# Altium project UZ_A_Testboard.PrjPcb
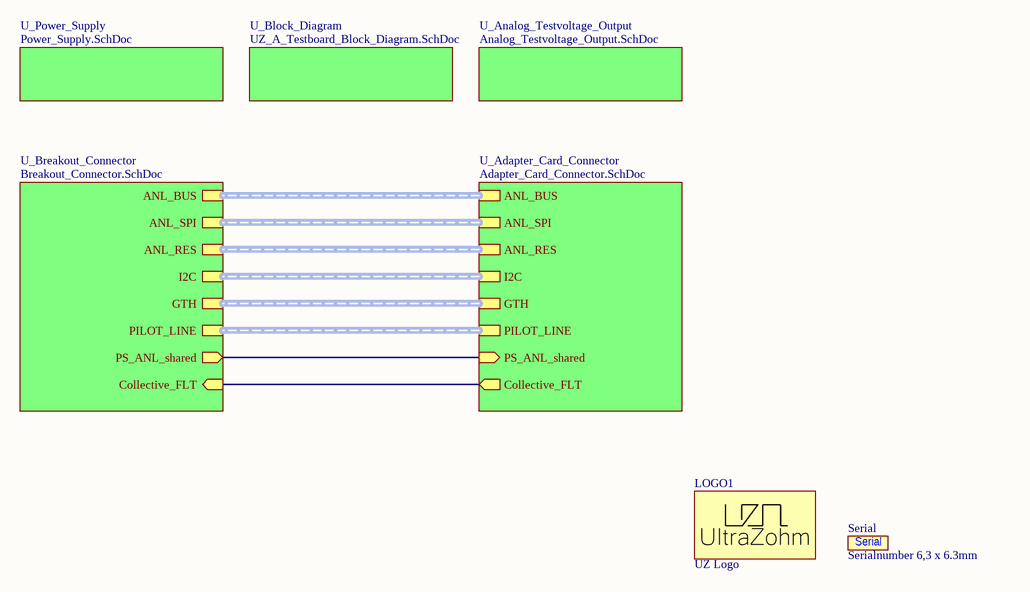
[diagram p0: Topsheet.SchDoc]
AuthorParam: Andreas Geiger; ProjectDate: 04/2021; ProjectRevision: Rev01
6 sheets, 57 parts. Net scope: hierarchical (ports join the sheet entries above them; power ports are global).
Board file: UZ_A_Testboard.PcbDoc
Sheets:
  Topsheet.SchDoc
    U_Adapter_Card_Connector = Adapter_Card_Connector.SchDoc
    U_Breakout_Connector = Breakout_Connector.SchDoc
    U_Power_Supply = Power_Supply.SchDoc
    U_Block_Diagram = UZ_A_Testboard_Block_Diagram.SchDoc
    U_Analog_Testvoltage_Output = Analog_Testvoltage_Output.SchDoc

## Sheet Topsheet.SchDoc
size A4; PageSetup: Record=PageOptions|CenterHorizontal=True|CenterVertical=True|PrintScale=0.92|XCorrection=1.00|YCorrection=1.00|PrintKind=0|BorderSize=5000000|LeftOffset=0|BottomOffset=0|Orientation=2|PaperLength=1000|PaperWidth=1000|Scale=100|PaperSource=7|PrintQuality=-4|MediaType=1|DitherType=10|PrintScaleMode=1|PaperKind=A4; Author: Andreas Geiger; CompanyName: Technische Hochschule Nürnberg Georg Simon Ohm; Organization: UltraZohm; Address1: Kesslerplatz 12; Address2: 90489 Nürnberg; Address3: GERMANY; DocumentNumber: 5; SheetNumber: 5; SheetTotal: 5; Website: www.ultrazohm.com

### Parts
LOGO1  UZ Logo  [UZ_Logo_small]  (no BOM)
Serial  Serialnumber 6,3 x 6.3mm  [Serial_6.3x6.3mm]  (no BOM)

### Sub-sheets
U_Adapter_Card_Connector = Adapter_Card_Connector.SchDoc: I2C (harness I2C), PILOT_LINE (harness PILOT_LINE), Collective_FLT (out), PS_ANL_shared (in), ANL_SPI (harness ANL_SPI), GTH (harness GTH), ANL_RES (harness ANL_RES), ANL_BUS (harness ANL_BUS)
U_Analog_Testvoltage_Output = Analog_Testvoltage_Output.SchDoc: no entries
U_Block_Diagram = UZ_A_Testboard_Block_Diagram.SchDoc: no entries
U_Breakout_Connector = Breakout_Connector.SchDoc: I2C (harness I2C), PILOT_LINE (harness PILOT_LINE), ANL_SPI (harness ANL_SPI), GTH (harness GTH), ANL_RES (harness ANL_RES), ANL_BUS (harness ANL_BUS), Collective_FLT (in), PS_ANL_shared (out)
U_Power_Supply = Power_Supply.SchDoc: no entries

### Nets
Collective_FLT: sheet U_Adapter_Card_Connector/Collective_FLT, sheet U_Breakout_Connector/Collective_FLT
PS_ANL_shared: sheet U_Adapter_Card_Connector/PS_ANL_shared, sheet U_Breakout_Connector/PS_ANL_shared

### Buses and harness runs
harness sheet U_Adapter_Card_Connector/ANL_BUS = sheet U_Breakout_Connector/ANL_BUS
harness sheet U_Adapter_Card_Connector/ANL_RES = sheet U_Breakout_Connector/ANL_RES
harness sheet U_Adapter_Card_Connector/ANL_SPI = sheet U_Breakout_Connector/ANL_SPI
harness sheet U_Adapter_Card_Connector/GTH = sheet U_Breakout_Connector/GTH
harness sheet U_Adapter_Card_Connector/I2C = sheet U_Breakout_Connector/I2C
harness sheet U_Adapter_Card_Connector/PILOT_LINE = sheet U_Breakout_Connector/PILOT_LINE

### Notes on the sheet
- Title
- Revision:
- Design Engineer:
- Date:
- Project:
- Sheet
- of

### Library data of the parts
LOGO1 = UZ Logo: UltraZohm Logo on PCB; Created: Jan2021_Liegmann; Value: UZ Logo
Serial = SerialNumber: Created: 2018_09_18_AGeiger; Value: Serialnumber 6,3 x 6.3mm

## Sheet Adapter_Card_Connector.SchDoc
size A4; PageSetup: Record=PageOptions|CenterHorizontal=True|CenterVertical=True|PrintScale=0.92|XCorrection=1.00|YCorrection=1.00|PrintKind=0|BorderSize=5000000|LeftOffset=0|BottomOffset=0|Orientation=2|PaperLength=1000|PaperWidth=1000|Scale=100|PaperSource=7|PrintQuality=-4|MediaType=1|DitherType=10|PrintScaleMode=1|PaperKind=A4; Author: Andreas Geiger; CompanyName: Technische Hochschule Nürnberg Georg Simon Ohm; Organization: UltraZohm; Address1: Kesslerplatz 12; Address2: 90489 Nürnberg; Address3: GERMANY; DocumentNumber: 2; SheetNumber: 2; SheetTotal: 5; Website: www.ultrazohm.com
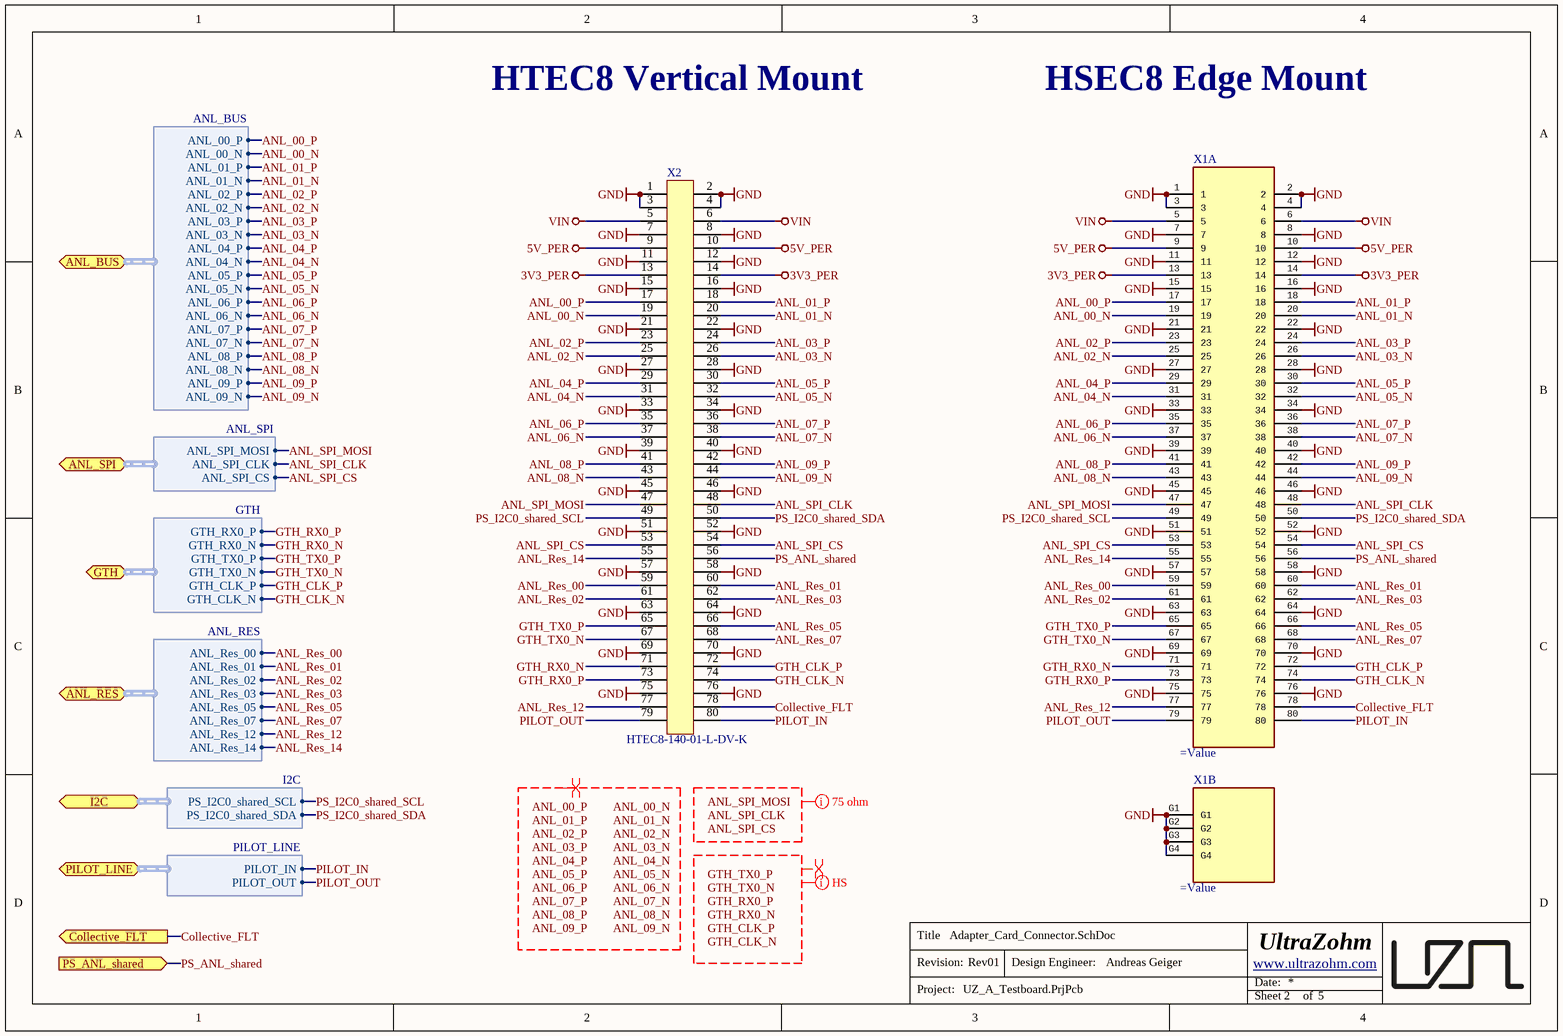
[diagram p1: Adapter_Card_Connector.SchDoc]

### Parts
X1  (no value)  [HSEC8-140-01-L-D-EM2]  (parts A,B of 2)
X2  HTEC8-140-01-L-DV-K  [HTEC8-140-XX-X-DV]

### Ports
ANL_BUS (bidir, harness ANL_BUS), ANL_RES (bidir, harness ANL_RES), ANL_SPI (bidir, harness ANL_SPI), Collective_FLT (out), GTH (bidir, harness GTH), I2C (bidir, harness I2C), PILOT_LINE (bidir, harness PILOT_LINE), PS_ANL_shared (in)

### Harnesses
I2C: PS_I2C0_shared_SDA, PS_I2C0_shared_SCL
PILOT_LINE: PILOT_OUT, PILOT_IN
ANL_BUS: ANL_00_P, ANL_00_N, ANL_01_P, ANL_01_N, ANL_02_P, ANL_02_N, ANL_03_P, ANL_03_N, ANL_04_P, ANL_04_N, ANL_05_P, ANL_05_N, ANL_06_P, ANL_06_N, ANL_07_P, ANL_07_N, ANL_08_P, ANL_08_N, ANL_09_P, ANL_09_N
ANL_RES: ANL_Res_00, ANL_Res_01, ANL_Res_02, ANL_Res_03, ANL_Res_05, ANL_Res_07, ANL_Res_12, ANL_Res_14
GTH: GTH_RX0_P, GTH_RX0_N, GTH_TX0_P, GTH_TX0_N, GTH_CLK_P, GTH_CLK_N
ANL_SPI: ANL_SPI_MOSI, ANL_SPI_CLK, ANL_SPI_CS

### Nets
3V3_PER: X1.13 X1.14 X2.13 X2.14
5V_PER: X1.9 X1.10 X2.9 X2.10
GND: X1.1 X1.2 X1.3 X1.4 X1.7 X1.8 X1.11 X1.12 X1.15 X1.16 X1.21 X1.22 X1.27 X1.28 X1.33 X1.34 X1.39 X1.40 X1.45 X1.46 X1.51 X1.52 X1.57 X1.58 X1.63 X1.64 X1.69 X1.70 X1.75 X1.76 X1.G1 X1.G2 X1.G3 X1.G4 X2.1 X2.2 X2.3 X2.4 X2.7 X2.8 X2.11 X2.12 X2.15 X2.16 X2.21 X2.22 X2.27 X2.28 X2.33 X2.34 X2.39 X2.40 X2.45 X2.46 X2.51 X2.52 X2.57 X2.58 X2.63 X2.64 X2.69 X2.70 X2.75 X2.76
VIN: X1.5 X1.6 X2.5 X2.6
ANL_00_N: X1.19 X2.19 ; port ANL_BUS.ANL_00_N
ANL_00_P: X1.17 X2.17 ; port ANL_BUS.ANL_00_P
ANL_01_N: X1.20 X2.20 ; port ANL_BUS.ANL_01_N
ANL_01_P: X1.18 X2.18 ; port ANL_BUS.ANL_01_P
ANL_02_N: X1.25 X2.25 ; port ANL_BUS.ANL_02_N
ANL_02_P: X1.23 X2.23 ; port ANL_BUS.ANL_02_P
ANL_03_N: X1.26 X2.26 ; port ANL_BUS.ANL_03_N
ANL_03_P: X1.24 X2.24 ; port ANL_BUS.ANL_03_P
ANL_04_N: X1.31 X2.31 ; port ANL_BUS.ANL_04_N
ANL_04_P: X1.29 X2.29 ; port ANL_BUS.ANL_04_P
ANL_05_N: X1.32 X2.32 ; port ANL_BUS.ANL_05_N
ANL_05_P: X1.30 X2.30 ; port ANL_BUS.ANL_05_P
ANL_06_N: X1.37 X2.37 ; port ANL_BUS.ANL_06_N
ANL_06_P: X1.35 X2.35 ; port ANL_BUS.ANL_06_P
ANL_07_N: X1.38 X2.38 ; port ANL_BUS.ANL_07_N
ANL_07_P: X1.36 X2.36 ; port ANL_BUS.ANL_07_P
ANL_08_N: X1.43 X2.43 ; port ANL_BUS.ANL_08_N
ANL_08_P: X1.41 X2.41 ; port ANL_BUS.ANL_08_P
ANL_09_N: X1.44 X2.44 ; port ANL_BUS.ANL_09_N
ANL_09_P: X1.42 X2.42 ; port ANL_BUS.ANL_09_P
ANL_Res_00: X1.59 X2.59 ; port ANL_RES.ANL_Res_00
ANL_Res_01: X1.60 X2.60 ; port ANL_RES.ANL_Res_01
ANL_Res_02: X1.61 X2.61 ; port ANL_RES.ANL_Res_02
ANL_Res_03: X1.62 X2.62 ; port ANL_RES.ANL_Res_03
ANL_Res_05: X1.66 X2.66 ; port ANL_RES.ANL_Res_05
ANL_Res_07: X1.68 X2.68 ; port ANL_RES.ANL_Res_07
ANL_Res_12: X1.77 X2.77 ; port ANL_RES.ANL_Res_12
ANL_Res_14: X1.55 X2.55 ; port ANL_RES.ANL_Res_14
ANL_SPI_CLK: X1.48 X2.48 ; port ANL_SPI.ANL_SPI_CLK
ANL_SPI_CS: X1.53 X1.54 X2.53 X2.54 ; port ANL_SPI.ANL_SPI_CS
ANL_SPI_MOSI: X1.47 X2.47 ; port ANL_SPI.ANL_SPI_MOSI
Collective_FLT: X1.78 X2.78 ; port Collective_FLT
GTH_CLK_N: X1.74 X2.74 ; port GTH.GTH_CLK_N
GTH_CLK_P: X1.72 X2.72 ; port GTH.GTH_CLK_P
GTH_RX0_N: X1.71 X2.71 ; port GTH.GTH_RX0_N
GTH_RX0_P: X1.73 X2.73 ; port GTH.GTH_RX0_P
GTH_TX0_N: X1.67 X2.67 ; port GTH.GTH_TX0_N
GTH_TX0_P: X1.65 X2.65 ; port GTH.GTH_TX0_P
PILOT_IN: X1.80 X2.80 ; port PILOT_LINE.PILOT_IN
PILOT_OUT: X1.79 X2.79 ; port PILOT_LINE.PILOT_OUT
PS_ANL_shared: X1.56 X2.56 ; port PS_ANL_shared
PS_I2C0_shared_SCL: X1.49 X2.49 ; port I2C.PS_I2C0_shared_SCL
PS_I2C0_shared_SDA: X1.50 X2.50 ; port I2C.PS_I2C0_shared_SDA

### Layout directives
net class S75: ANL_SPI_CLK, ANL_SPI_CS, ANL_SPI_MOSI
differential pair: ANL_00_N, ANL_00_P, ANL_01_N, ANL_01_P, ANL_02_N, ANL_02_P, ANL_03_N, ANL_03_P, ANL_04_N, ANL_04_P, ANL_05_N, ANL_05_P, ANL_06_N, ANL_06_P, ANL_07_N, ANL_07_P, ANL_08_N, ANL_08_P, ANL_09_N, ANL_09_P, GTH_CLK_N, GTH_CLK_P, GTH_RX0_N, GTH_RX0_P, GTH_TX0_N, GTH_TX0_P
net class HS: GTH_CLK_N, GTH_CLK_P, GTH_RX0_N, GTH_RX0_P, GTH_TX0_N, GTH_TX0_P

### Notes on the sheet
- HTEC8 Vertical Mount
- HSEC8 Edge Mount
- Labels drawn without touching a wire or pin: ANL_00_N, ANL_00_P, ANL_01_N, ANL_01_P, ANL_02_N, ANL_02_P, ANL_03_N, ANL_03_P, ANL_04_N, ANL_04_P, ANL_05_N, ANL_05_P, ANL_06_N, ANL_06_P, ANL_07_N, ANL_07_P, ANL_08_N, ANL_08_P, ANL_09_N, ANL_09_P, ANL_SPI_CLK, ANL_SPI_CS, ANL_SPI_MOSI, GTH_CLK_N, GTH_CLK_P, GTH_RX0_N, GTH_RX0_P, GTH_TX0_N, GTH_TX0_P
- Title
- Revision:
- Design Engineer:
- Date:
- Project:
- Sheet
- of

### Library data of the parts
X1 = HSEC8-140-01-L-D-EM2J: 80 Position Female Connector Non Specified - Dual Edge Gold 0.031" (0.80mm) Black; MF: SAMTEC; MPN: HSEC8-140-01-L-D-EM2; Created: 2021_04_07_AGeiger; Value: HSEC8-140-01-L-D-EM2
X2 = 30758: AN: 30758; Mixed: SMT; Temperature-Range: -55/+125; Extra: Samtec 0.80 mm High-Speed Edge Card Connector, 80pin 10µ Plating; Case: HTEC8; HelpURL: b:\AD\adlib\datasheet\Samtec\HTEC8\; H-ART: HTEC8-140-01-L-DV-K

## Sheet Breakout_Connector.SchDoc
size A4; PageSetup: Record=PageOptions|CenterHorizontal=True|CenterVertical=True|PrintScale=0.92|XCorrection=1.00|YCorrection=1.00|PrintKind=0|BorderSize=5000000|LeftOffset=0|BottomOffset=0|Orientation=2|PaperLength=1000|PaperWidth=1000|Scale=100|PaperSource=7|PrintQuality=-4|MediaType=1|DitherType=10|PrintScaleMode=1|PaperKind=A4; Author: Andreas Geiger; CompanyName: Technische Hochschule Nürnberg Georg Simon Ohm; Organization: UltraZohm; Address1: Kesslerplatz 12; Address2: 90489 Nürnberg; Address3: GERMANY; DocumentNumber: 3; SheetNumber: 3; SheetTotal: 5; Website: www.ultrazohm.com
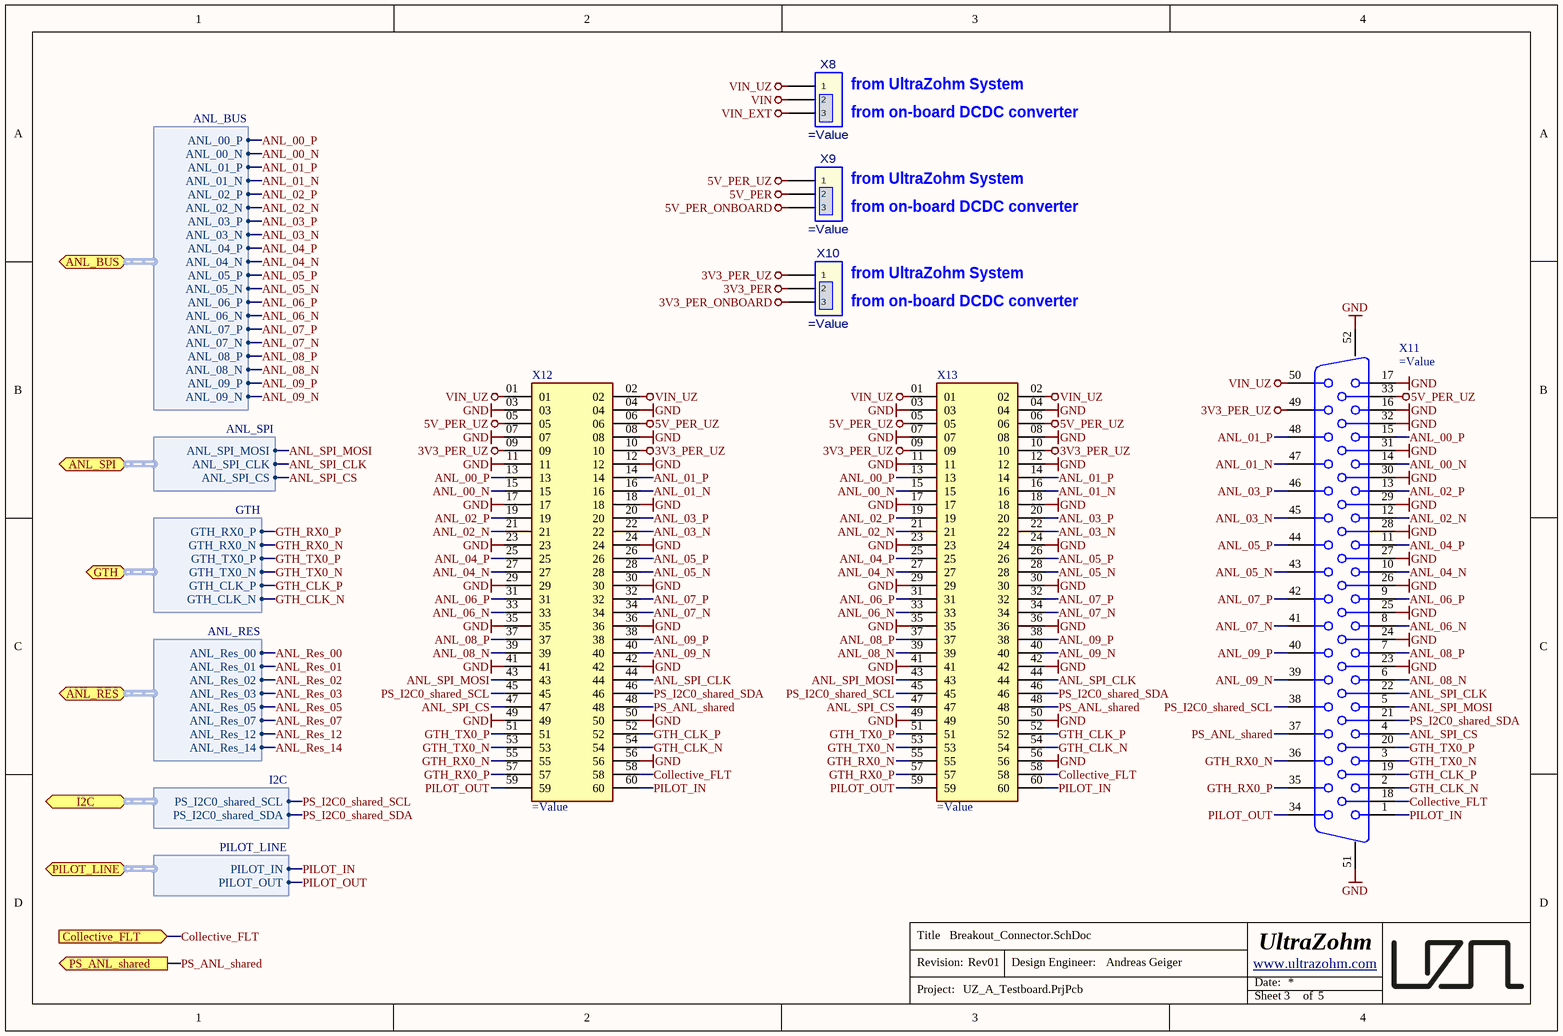
[diagram p2: Breakout_Connector.SchDoc]

### Parts
X8  (no value)  [TSW-103-XX-XXX-S]
X9  (no value)  [TSW-103-XX-XXX-S]
X10  (no value)  [TSW-103-XX-XXX-S]
X11  (no value)  [dsub50_female_164A18759X]
X12  (no value)  [TSM-130-01-F-DV]
X13  (no value)  [HTSS-130-01-L-DV]

### Ports
ANL_BUS (bidir, harness ANL_BUS), ANL_RES (bidir, harness ANL_RES), ANL_SPI (bidir, harness ANL_SPI), Collective_FLT (in), GTH (bidir, harness GTH), I2C (bidir, harness I2C), PILOT_LINE (bidir, harness PILOT_LINE), PS_ANL_shared (out)

### Harnesses
I2C: PS_I2C0_shared_SDA, PS_I2C0_shared_SCL
PILOT_LINE: PILOT_OUT, PILOT_IN
ANL_BUS: ANL_00_P, ANL_00_N, ANL_01_P, ANL_01_N, ANL_02_P, ANL_02_N, ANL_03_P, ANL_03_N, ANL_04_P, ANL_04_N, ANL_05_P, ANL_05_N, ANL_06_P, ANL_06_N, ANL_07_P, ANL_07_N, ANL_08_P, ANL_08_N, ANL_09_P, ANL_09_N
ANL_RES: ANL_Res_00, ANL_Res_01, ANL_Res_02, ANL_Res_03, ANL_Res_05, ANL_Res_07, ANL_Res_12, ANL_Res_14
GTH: GTH_RX0_P, GTH_RX0_N, GTH_TX0_P, GTH_TX0_N, GTH_CLK_P, GTH_CLK_N
ANL_SPI: ANL_SPI_MOSI, ANL_SPI_CLK, ANL_SPI_CS

### Nets
3V3_PER: X10.2
3V3_PER_ONBOARD: X10.3
3V3_PER_UZ: X10.1 X11.49 X12.09 X12.10 X13.09 X13.10
5V_PER: X9.2
5V_PER_ONBOARD: X9.3
5V_PER_UZ: X9.1 X11.33 X12.05 X12.06 X13.05 X13.06
GND: X11.16 X11.17 X11.23 X11.24 X11.25 X11.26 X11.27 X11.28 X11.29 X11.30 X11.31 X11.32 X11.51 X11.52 X12.03 X12.04 X12.07 X12.08 X12.11 X12.12 X12.17 X12.18 X12.23 X12.24 X12.29 X12.30 X12.35 X12.36 X12.41 X12.42 X12.49 X12.50 X12.56 X13.03 X13.04 X13.07 X13.08 X13.11 X13.12 X13.17 X13.18 X13.23 X13.24 X13.29 X13.30 X13.35 X13.36 X13.41 X13.42 X13.49 X13.50 X13.56
VIN: X8.2
VIN_EXT: X8.3
VIN_UZ: X8.1 X11.50 X12.01 X12.02 X13.01 X13.02
ANL_00_N: X11.14 X12.15 X13.15 ; port ANL_BUS.ANL_00_N
ANL_00_P: X11.15 X12.13 X13.13 ; port ANL_BUS.ANL_00_P
ANL_01_N: X11.47 X12.16 X13.16 ; port ANL_BUS.ANL_01_N
ANL_01_P: X11.48 X12.14 X13.14 ; port ANL_BUS.ANL_01_P
ANL_02_N: X11.12 X12.21 X13.21 ; port ANL_BUS.ANL_02_N
ANL_02_P: X11.13 X12.19 X13.19 ; port ANL_BUS.ANL_02_P
ANL_03_N: X11.45 X12.22 X13.22 ; port ANL_BUS.ANL_03_N
ANL_03_P: X11.46 X12.20 X13.20 ; port ANL_BUS.ANL_03_P
ANL_04_N: X11.10 X12.27 X13.27 ; port ANL_BUS.ANL_04_N
ANL_04_P: X11.11 X12.25 X13.25 ; port ANL_BUS.ANL_04_P
ANL_05_N: X11.43 X12.28 X13.28 ; port ANL_BUS.ANL_05_N
ANL_05_P: X11.44 X12.26 X13.26 ; port ANL_BUS.ANL_05_P
ANL_06_N: X11.8 X12.33 X13.33 ; port ANL_BUS.ANL_06_N
ANL_06_P: X11.9 X12.31 X13.31 ; port ANL_BUS.ANL_06_P
ANL_07_N: X11.41 X12.34 X13.34 ; port ANL_BUS.ANL_07_N
ANL_07_P: X11.42 X12.32 X13.32 ; port ANL_BUS.ANL_07_P
ANL_08_N: X11.6 X12.39 X13.39 ; port ANL_BUS.ANL_08_N
ANL_08_P: X11.7 X12.37 X13.37 ; port ANL_BUS.ANL_08_P
ANL_09_N: X11.39 X12.40 X13.40 ; port ANL_BUS.ANL_09_N
ANL_09_P: X11.40 X12.38 X13.38 ; port ANL_BUS.ANL_09_P
ANL_SPI_CLK: X11.22 X12.44 X13.44 ; port ANL_SPI.ANL_SPI_CLK
ANL_SPI_CS: X11.4 X12.47 X13.47 ; port ANL_SPI.ANL_SPI_CS
ANL_SPI_MOSI: X11.5 X12.43 X13.43 ; port ANL_SPI.ANL_SPI_MOSI
Collective_FLT: X11.18 X12.58 X13.58 ; port Collective_FLT
GTH_CLK_N: X11.2 X12.54 X13.54 ; port GTH.GTH_CLK_N
GTH_CLK_P: X11.19 X12.52 X13.52 ; port GTH.GTH_CLK_P
GTH_RX0_N: X11.36 X12.55 X13.55 ; port GTH.GTH_RX0_N
GTH_RX0_P: X11.35 X12.57 X13.57 ; port GTH.GTH_RX0_P
GTH_TX0_N: X11.3 X12.53 X13.53 ; port GTH.GTH_TX0_N
GTH_TX0_P: X11.20 X12.51 X13.51 ; port GTH.GTH_TX0_P
PILOT_IN: X11.1 X12.60 X13.60 ; port PILOT_LINE.PILOT_IN
PILOT_OUT: X11.34 X12.59 X13.59 ; port PILOT_LINE.PILOT_OUT
PS_ANL_shared: X11.37 X12.48 X13.48 ; port PS_ANL_shared
PS_I2C0_shared_SCL: X11.38 X12.45 X13.45 ; port I2C.PS_I2C0_shared_SCL
PS_I2C0_shared_SDA: X11.21 X12.46 X13.46 ; port I2C.PS_I2C0_shared_SDA

### Notes on the sheet
- (near X8) from UltraZohm System
- (near X8) from on-board DCDC converter
- (near X9) from UltraZohm System
- (near X9) from on-board DCDC converter
- (near X10) from UltraZohm System
- (near X10) from on-board DCDC converter
- Title
- Revision:
- Design Engineer:
- Date:
- Project:
- Sheet
- of

### Library data of the parts
X8-X10 = TSW-103-XX-XXX-S: .025[0.64] SQ. POST TERMINAL STRIP ASSEMBLY.; Manufacturer: SAMTEC; MPN: TSW-103-07-F-S; Value: TSW-103-07-F-S; Created: 2020_11_26_AGeiger
X11 = DSUB50_female: D-SUB, female, right angle, 50pos, 9.4mm pitch; MPN: 164A18759X; MF: CONEC; Value: 164A18759X; Supplier Part Number 1: D-SUB BU 50GWC; ComponentLink1Description: Datasheet; ComponentLink1URL: http://www.conec.com/catalog/media/conec/DRAWINGS/164A18759X.pdf; Supplier Part Number 2: 706-164A18759X; Supplier 1: Reichelt; Supplier 2: Mouser; Supplier 3: Digi-Key; Supplier Part Number 3: 164A18759X-ND; Created: 2019_10_24_AGeiger
X12 = TSM-130-01-F-DV: MF: Samtec; MPN: TSM-130-01-F-DV; Value: TSM-130-01-F-DV; Created: 2021_03_23_AGeiger
X13 = HTSS-130-01-L-DV: MF: SAMTEC; Value: HTSS-130-01-L-DV; MPN: HTSS-130-01-L-DV

## Sheet Power_Supply.SchDoc
size A4; PageSetup: Record=PageOptions|CenterHorizontal=True|CenterVertical=True|PrintScale=0.92|XCorrection=1.00|YCorrection=1.00|PrintKind=0|BorderSize=5000000|LeftOffset=0|BottomOffset=0|Orientation=2|PaperLength=1000|PaperWidth=1000|Scale=100|PaperSource=7|PrintQuality=-4|MediaType=1|DitherType=10|PrintScaleMode=1|PaperKind=A4; Author: Andreas Geiger; CompanyName: Technische Hochschule Nürnberg Georg Simon Ohm; Organization: UltraZohm; Address1: Kesslerplatz 12; Address2: 90489 Nürnberg; Address3: GERMANY; DocumentNumber: 4; SheetNumber: 4; SheetTotal: 5; Website: www.ultrazohm.com
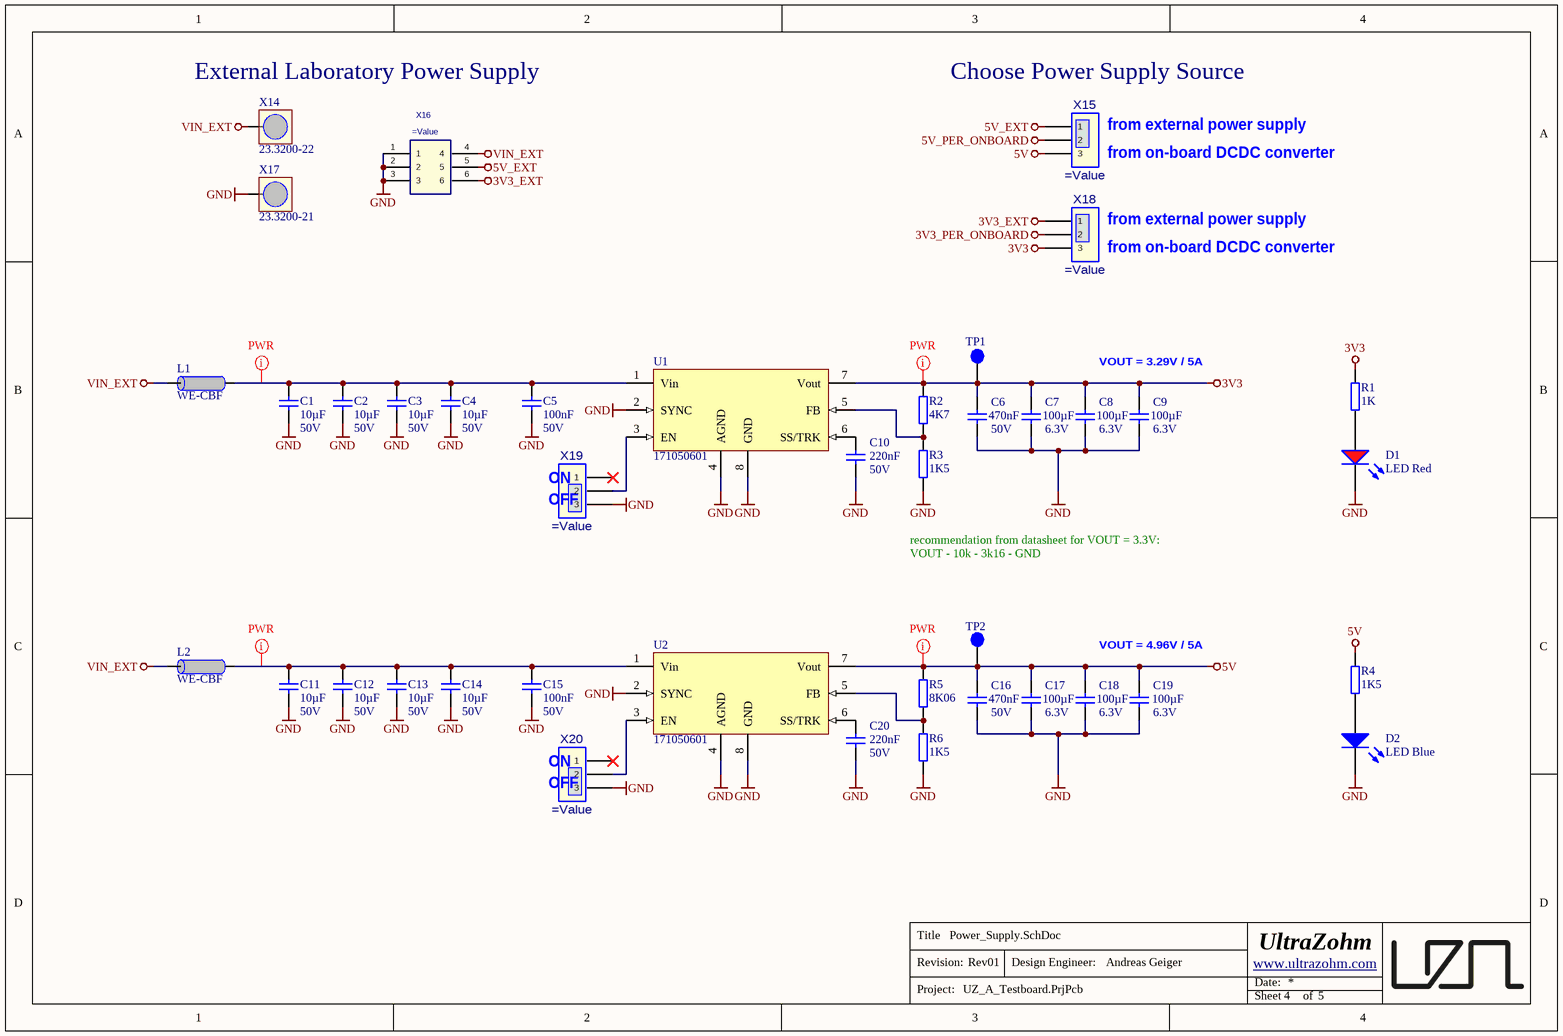
[diagram p3: Power_Supply.SchDoc]

### Parts
C1  10µF  Voltage: 50V  [CAPC3216X180N_V]
C2  10µF  Voltage: 50V  [CAPC3216X180N_V]
C3  10µF  Voltage: 50V  [CAPC3216X180N_V]
C4  10µF  Voltage: 50V  [CAPC3216X180N_V]
C5  100nF  Voltage: 50V  [CAPC1608X90N_V]
C6  470nF  Voltage: 50V  [CAPC1608X90N_V]
C7  100µF  Voltage: 6.3V  [CAPC3216X180N_V]
C8  100µF  Voltage: 6.3V  [CAPC3216X180N_V]
C9  100µF  Voltage: 6.3V  [CAPC3216X180N_V]
C10  220nF  Voltage: 50V  [CAPC1608X90N_V]
C11  10µF  Voltage: 50V  [CAPC3216X180N_V]
C12  10µF  Voltage: 50V  [CAPC3216X180N_V]
C13  10µF  Voltage: 50V  [CAPC3216X180N_V]
C14  10µF  Voltage: 50V  [CAPC3216X180N_V]
C15  100nF  Voltage: 50V  [CAPC1608X90N_V]
C16  470nF  Voltage: 50V  [CAPC1608X90N_V]
C17  100µF  Voltage: 6.3V  [CAPC3216X180N_V]
C18  100µF  Voltage: 6.3V  [CAPC3216X180N_V]
C19  100µF  Voltage: 6.3V  [CAPC3216X180N_V]
C20  220nF  Voltage: 50V  [CAPC1608X90N_V]
D1  LED Red  [WL-SMCW_0603]
D2  LED Blue  [WL-SMCW_0603]
L1  WE-CBF  [INDC2012X92N_V]
L2  WE-CBF  [INDC2012X92N_V]
R1  1K  [RESC1608X55N_V]
R2  4K7  [RESC1608X55N_V]
R3  1K5  [RESC1608X55N_V]
R4  1K5  [RESC1608X55N_V]
R5  8K06  [RESC1608X55N_V]
R6  1K5  [RESC1608X55N_V]
TP1  Testpoint 1mm  [TP_1mm]  (value not drawn)
TP2  Testpoint 1mm  [TP_1mm]  (value not drawn)
U1  171050601  [7TO-PMOD]
U2  171050601  [7TO-PMOD]
X14  23.3200-22  [Bannanenbuchse Rot Stäubli 23.3200-22]
X15  (no value)  [TSW-103-XX-XXX-S]
X16  (no value)  [IPL1-103-01-L-D-RA-K]
X17  23.3200-21  [Bannanenbuchse Schwarz Stäubli 23.3200-21]
X18  (no value)  [TSW-103-XX-XXX-S]
X19  (no value)  [TSW-103-XX-XXX-S]
X20  (no value)  [TSW-103-XX-XXX-S]

### Nets
3V3: C6.1 C7.1 C8.1 C9.1 R1.2 R2.2 TP1.1 U1.7(Vout) X18.3
3V3_EXT: X16.6 X18.1
3V3_PER_ONBOARD: X18.2
5V: C16.1 C17.1 C18.1 C19.1 R4.2 R5.2 TP2.1 U2.7(Vout) X15.3
5V_EXT: X15.1 X16.5
5V_PER_ONBOARD: X15.2
GND: C1.2 C2.2 C3.2 C4.2 C5.1 C6.2 C7.2 C8.2 C9.2 C10.2 C11.2 C12.2 C13.2 C14.2 C15.1 C16.2 C17.2 C18.2 C19.2 C20.2 D1.1(K) D2.1(K) R3.1 R6.2 U1.2(SYNC) U1.4(AGND) U1.8(GND) U2.2(SYNC) U2.4(AGND) U2.8(GND) X16.1 X16.2 X16.3 X17.1 X19.3 X20.3
VIN_EXT: L1.2 L2.2 X14.1 X16.4
NetC1_1: C1.1 C2.1 C3.1 C4.1 C5.2 L1.1 U1.1(Vin)
NetC10_1: C10.1 U1.6(SS/TRK)
NetC11_1: C11.1 C12.1 C13.1 C14.1 C15.2 L2.1 U2.1(Vin)
NetC20_1: C20.1 U2.6(SS/TRK)
NetD1_2: D1.2(A) R1.1
NetD2_2: D2.2(A) R4.1
NetR2_1: R2.1 R3.2 U1.5(FB)
NetR5_1: R5.1 R6.1 U2.5(FB)
NetU1_3: U1.3(EN) X19.2
NetU2_3: U2.3(EN) X20.2

Not connected (* = marked no-connect by the designer): X19 1*; X20 1*

### Layout directives
net class PWR: 3V3, 5V, NetC1_1, NetC11_1

### Notes on the sheet
- (near X14) External Laboratory Power Supply
- (near X15) Choose Power Supply Source
- (near X15) from external power supply
- (near X15) from on-board DCDC converter
- (near X18) from external power supply
- (near X18) from on-board DCDC converter
- VOUT = 3.29V / 5A
- ON
- (near X19) OFF
- recommendation from datasheet for VOUT = 3.3V:
  VOUT - 10k - 3k16 - GND
- VOUT = 4.96V / 5A
- (near X20) OFF
- Title
- Revision:
- Design Engineer:
- Date:
- Project:
- Sheet
- of

### Library data of the parts
C1-C4 C11-C14 = 24685: KON 10µF 50V X5R 10%  SMD BF 3216 (1206); Value: 10u; AN: 24685; Mixed: SMT; Temperature-Range: -55/+85; Preferred: Yes; Technology: X5R; Case: 3216 (1206); Tolerance: 10%
C5 C15 = 21382: KON 100nF 50V X7R ±10% SMD BF 1608 (0603); Value: 100n; AN: 21382; Mixed: SMT; Preferred: Yes; Temperature-Range: -55/+125; Tolerance: ±10%; Technology: X7R; Case: 1608 (0603)
C6 C16 = 25476: KON 470nF 50V X7R SMD  BF 1608 (0603); Value: 470n; AN: 25476; Mixed: SMT; Preferred: Yes; Temperature-Range: -55/+125; Technology: X7R; Case: 1608 (0603)
C7-C9 C17-C19 = 23116: KON 100µF 6,3V X5R 20% SMD BF 3216 (1206); AN: 23116; Mixed: SMT; Value: 100u; Preferred: Yes; Temperature-Range: -55/+85; Technology: X5R; Case: 3216 (1206); Tolerance: 20%
C10 C20 = 29694: KON 220nF 50V X7R ±10% SMD BF 1608 (0603); Value: 220n; AN: 29694; Mixed: SMT; Temperature-Range: -55/+125; Tolerance: ±10%; Technology: X7R; Case: 1608 (0603)
D1 = KT-0603R: LED RED 520~625NM 90~100MCD@20MA TOP VIEW 0603 ROHS; Manufacturer: Hubei KENTO Elec; Type: Standard; Created from: T. Wendt; Forward Current I_f: 20 mA; Forward Voltage U_f: 2.1 V; Wavelength: 620 nm; Light Intensity: 110 mcd; Nominal Power: 42 mW; Manufacturer Part Number: KT-0603R; PartID: 8; Created On: 03.03.2021 10:06:23; ComponentLink1Description: Datasheet; ComponentLink1URL: https://datasheet.lcsc.com/szlcsc/Hubei-KENTO-Elec-KT-0603R_C2286.pdf; Component Type: LED Diode; Device Package: 0603; Last Updated: 04.03.2021 09:02:49; Mounting Type: SMD; Operating Temperature: -40 - 85 °C; Supplier 1: LCSC; Supplier Part Number 1: C2286; Live Cycle Status: 1; Stock number: not stored; Color: red; LCSC Part Number: C2286
D2 = 19-217/BHC-ZL1M2RY/3T: LED BLUE 465~475NM 11.5~28.5MCD@5MA TOP VIEW 0603 ROHS; Manufacturer: Everlight Elec; Type: Standard; Created from: T. Wendt; Forward Current I_f: 20 mA; Forward Voltage U_f: 2.8 V; Wavelength: 470 nm; Nominal Power: 68 mW; Manufacturer Part Number: 19-217/BHC-ZL1M2RY/3T; PartID: 6; Created On: 03.03.2021 09:59:51; ComponentLink1Description: Datasheet; ComponentLink1URL: https://datasheet.lcsc.com/szlcsc/Everlight-Elec-19-217-BHC-ZL1M2RY-3T_C72041.pdf; Component Type: LED Diode; Device Package: 0603; Last Updated: 04.03.2021 09:02:49; Mounting Type: SMD; Operating Temperature: -40 - 85 °C; Supplier 1: LCSC; Supplier Part Number 1: C72041; Live Cycle Status: 1; Stock number: not stored; Color: blue; Light Intensity: 28.5 mcd; LCSC Part Number: C72041
L1 L2 = 24513: Ferritdurchführung SMD 0805; AN: 24513; Voltage: 2000mA; Mixed: SMT; Trenz-Stock: Yes; H-ART: 742792040; Extra: 0,15 Ohm DC, 600 Ohm bei 100MHz, 700 Ohm bei 150Mhz, 2000mA; Case: 2012 (0805); Technology: 0.15Ohm; HelpURL: B:\AD\adlib\datasheet\742792040
R1 = 21375: WID SMD 1K 1% 0,1W; AN: 21375; Mixed: SMT; Preferred: Yes; Extra: BF 1608 (0603); Value: 1K; Tolerance: 1%; Case: 1608 (0603); Technology: TK100
R2 = 21378: WID SMD 4K7 1% 0,1W BF 1608 (0603); Value: 4.7K; AN: 21378; Mixed: SMT; Preferred: Yes; Tolerance: 1%; Case: 1608 (0603); Technology: TK100
R3 R4 = 21514: WID SMD 1K5 1% 0,1W; Value: 1.5K; AN: 21514; Mixed: SMT; Extra: BF 1608 (0603); Tolerance: 1%; Case: 1608 (0603); Technology: TK100
R5 = 21378: WID SMD 8K06 1% 0,1W BF 1608 (0603); Value: 8.06K; Mixed: SMT; Preferred: Yes; Tolerance: 1%; Case: 1608 (0603); Technology: TK100
R6 = 21514: WID SMD 1K5 1% 0,1W; AN: 21514; Mixed: SMT; Value: 1.5K; Extra: BF 1608 (0603); Tolerance: 1%; Case: 1608 (0603); Technology: TK100
TP1 TP2 = 25063: AN: 25063; Mixed: SMT
U1 U2 = 26051: AN: 26051; Mixed: SMT; Extra: 6-36V 5A MagI³C Power Module; Voltage: Adj.; Temperature-Range: -40/+125 (Tj); HelpURL: B:\AD\adlib\datasheet\171050601; Case: TO263-7EP; H-ART: 171050601; Storage-Temperature: -65/+150 (Abs)
X14 = Banannenstecker-Buchse Stäubli Rot: MULTI-CONTACT   23.3200-22   BANANA SOCKET, 24A, 4MM, THT, R/A, RED; Voltage Rating: 1kV; Gender: Female; Part Number: 23.3200-22; Manufacturer: Stäubli; PnP Value: 23.3200-22; Value: 23.3200-22; Supplier 1: Farnell; Manufacturer Part Number: 23.3200-22; RoHS: Yes; Category: Uncategorized; Stock 1: 1111; Pricing 1: 1=10,51000, 5=8,01000, 10=7,81000, 25=6,92000, 50=6,48000, 75=6,35000 (EUR); Color: Red; Contact Material: Brass,Gold; Contact Plating: Gold; Insulation Material: PVC; Min Operating Temperature: -40°C; Max Operating Temperature: 80°C; Current Rating: 24A; Connector Type: Socket; Termination: Through Hole; Voltage Rating (DC): 1kV; Voltage Rating (AC): 1kV; Length: 33mm; REACH SVHC: No SVHC; ComponentLink1URL: https://datasheet.ciiva.com/1123/308583-1123144.pdf?src-supplier=Newark; ComponentLink1Description: https://datasheet.ciiva.com/1123/308583-1123144.pdf?src-supplier=Newark; ComponentLink2URL: https://datasheet.ciiva.com/16979/0900766b8025b994-16979960.pdf?src-supplier=Allied+Electronics; ComponentLink2Description: https://datasheet.ciiva.com/16979/0900766b8025b994-16979960.pdf?src-supplier=Allied+Electronics; ComponentLink3URL: https://datasheet.ciiva.com/29247/731096-da-01-ml-4-mm-einbaub-slb4i-90-rot-de-en-fr-29247831.pdf?src-supplier=Conrad; ComponentLink3Description: https://datasheet.ciiva.com/29247/731096-da-01-ml-4-mm-einbaub-slb4i-90-rot-de-en-fr-29247831.pdf?src-supplier=Conrad; PnP Package: BANANA SOCKET; Supplier Part Number 1: 4130261
X15 X18-X20 = TSW-103-XX-XXX-S: as X8 on sheet Breakout_Connector; Created: 2020_11_26_AGeiger
X16 = IPL1-103-XX-X-D-X: 2.54mm Double Row Terminal Assembly; MF: SAMTEC; Created: 2018_05_02_AGeiger; Value: =MPN; MPN: IPL1-103-01-L-D-RA-K
X17 = Banannenstecker-Buchse Stäubli Schwarz: MULTI-CONTACT   23.3200-21   BANANA SOCKET, 24A, 4MM, THT, R/A, Black; Voltage Rating: 1kV; Gender: Female; Part Number: 23.3200-21; Manufacturer: Stäubli; PnP Value: 23.3200-21; Value: 23.3200-21; Manufacturer Part Number: 23.3200-21; RoHS: Yes; Category: Uncategorized; Color: Black; Contact Material: Brass,Gold; Contact Plating: Gold; Insulation Material: PVC; Min Operating Temperature: -40°C; Max Operating Temperature: 80°C; Current Rating: 24A; Connector Type: Socket; Termination: Through Hole; Voltage Rating (DC): 1kV; Voltage Rating (AC): 1kV; Length: 33mm; REACH SVHC: No SVHC; ComponentLink1URL: https://datasheet.ciiva.com/1123/308583-1123144.pdf?src-supplier=Newark; ComponentLink1Description: https://datasheet.ciiva.com/1123/308583-1123144.pdf?src-supplier=Newark; ComponentLink2URL: https://datasheet.ciiva.com/16979/0900766b8025b994-16979960.pdf?src-supplier=Allied+Electronics; ComponentLink2Description: https://datasheet.ciiva.com/16979/0900766b8025b994-16979960.pdf?src-supplier=Allied+Electronics; ComponentLink3URL: https://datasheet.ciiva.com/29247/731096-da-01-ml-4-mm-einbaub-slb4i-90-rot-de-en-fr-29247831.pdf?src-supplier=Conrad; ComponentLink3Description: https://datasheet.ciiva.com/29247/731096-da-01-ml-4-mm-einbaub-slb4i-90-rot-de-en-fr-29247831.pdf?src-supplier=Conrad; PnP Package: BANANA SOCKET; Supplier 1: Farnell; Supplier Part Number 1: 1085521

## Sheet UZ_A_Testboard_Block_Diagram.SchDoc
size A4; PageSetup: Record=PageOptions|CenterHorizontal=True|CenterVertical=True|PrintScale=0.92|XCorrection=1.00|YCorrection=1.00|PrintKind=0|BorderSize=5000000|LeftOffset=0|BottomOffset=0|Orientation=2|PaperLength=1000|PaperWidth=1000|Scale=100|PaperSource=7|PrintQuality=-4|MediaType=1|DitherType=10|PrintScaleMode=1|PaperKind=A4; Author: Andreas Geiger; CompanyName: Technische Hochschule Nürnberg Georg Simon Ohm; Organization: UltraZohm; Address1: Kesslerplatz 12; Address2: 90489 Nürnberg; Address3: GERMANY; DocumentNumber: 1; SheetNumber: 1; SheetTotal: 2; Website: www.ultrazohm.com
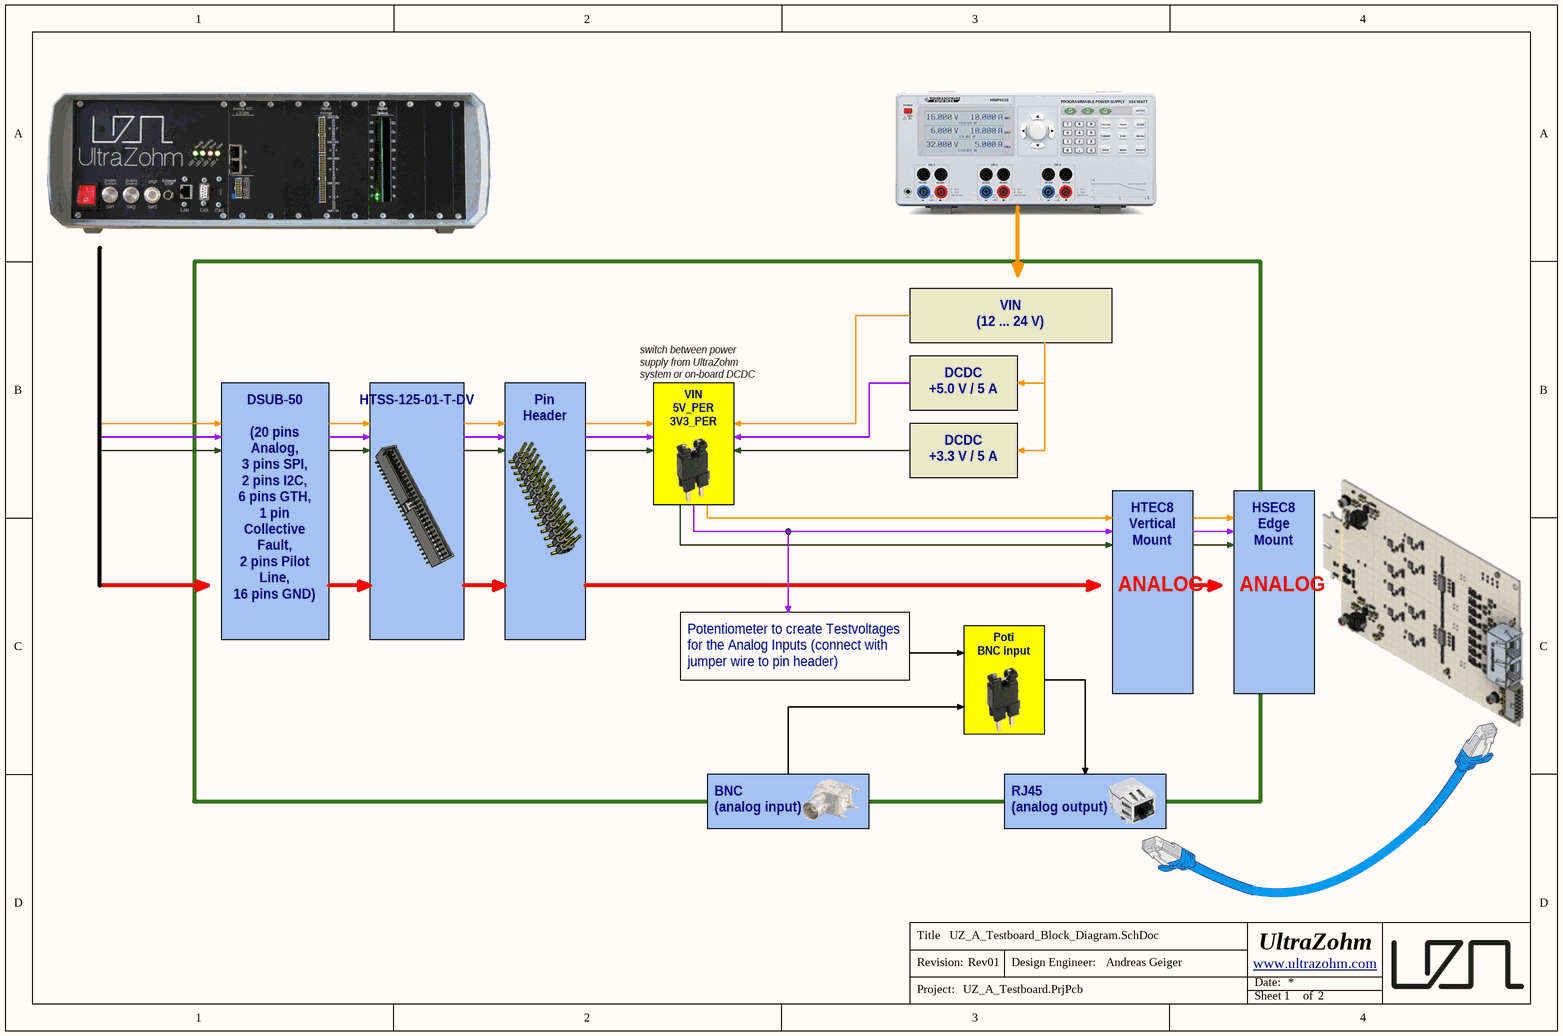
[diagram p4: UZ_A_Testboard_Block_Diagram.SchDoc]

### Notes on the sheet
- switch between power supply from UltraZohm system or on-board DCDC
- VIN
  (12 ... 24 V)
- DCDC
  +5.0 V / 5 A
- VIN
  5V_PER
  3V3_PER
- DCDC
  +3.3 V / 5 A
- DSUB-50
  (20 pins Analog,
  3 pins SPI,
  2 pins I2C,
  6 pins GTH,
  1 pin Collective Fault,
  2 pins Pilot Line,
  16 pins GND)
- HTSS-125-01-T-DV
- Pin Header
- ANALOG
- Potentiometer to create Testvoltages for the Analog Inputs (connect with jumper wire to pin header)
- HTEC8
  Vertical Mount
- HSEC8
  Edge Mount
- Poti
  BNC input
- BNC
  (analog input)
- RJ45
  (analog output)
- Title
- Revision:
- Design Engineer:
- Date:
- Project:
- Sheet
- of

## Sheet Analog_Testvoltage_Output.SchDoc
size A4; PageSetup: Record=PageOptions|CenterHorizontal=True|CenterVertical=True|PrintScale=0.92|XCorrection=1.00|YCorrection=1.00|PrintKind=0|BorderSize=5000000|LeftOffset=0|BottomOffset=0|Orientation=2|PaperLength=1000|PaperWidth=1000|Scale=100|PaperSource=7|PrintQuality=-4|MediaType=1|DitherType=10|PrintScaleMode=1|PaperKind=A4; Author: Andreas Geiger; CompanyName: Technische Hochschule Nürnberg Georg Simon Ohm; Organization: UltraZohm; Address1: Kesslerplatz 12; Address2: 90489 Nürnberg; Address3: GERMANY; DocumentNumber: 3; SheetNumber: 3; SheetTotal: 5; Website: www.ultrazohm.com
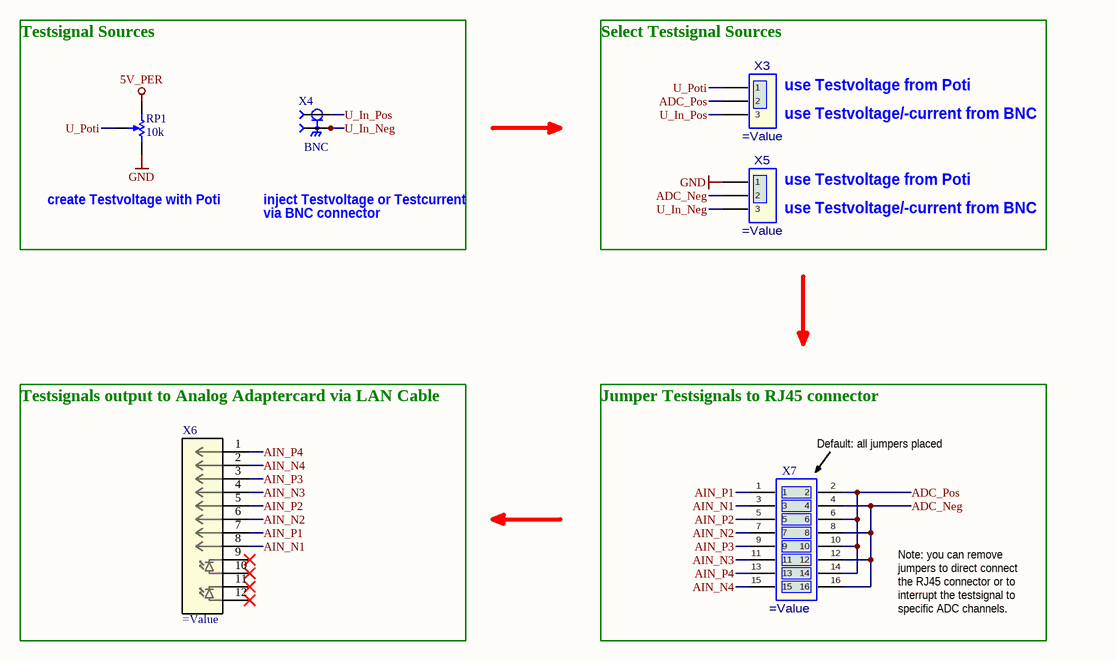
[diagram p5: Analog_Testvoltage_Output.SchDoc]

### Parts
RP1  10k  [BOURNS_3299W-3_V]
X3  (no value)  [TSW-103-XX-XXX-S]
X4  BNC  [SAMTEC_BNC7T-J-P-XX-RA-BH1]
X5  (no value)  [TSW-103-XX-XXX-S]
X6  (no value)  [RJ45_RJHSE-5384_AMP]
X7  (no value)  [TSW-108-XX-XXX-D]

### Blocks framed on the sheet
Default: all jumpers placed: X7

### Nets
5V_PER: RP1.1
GND: RP1.3 X5.1
ADC_Neg: X5.2 X7.4 X7.8 X7.12 X7.16
ADC_Pos: X3.2 X7.2 X7.6 X7.10 X7.14
AIN_N1: X6.8 X7.3
AIN_N2: X6.6 X7.7
AIN_N3: X6.4 X7.11
AIN_N4: X6.2 X7.15
AIN_P1: X6.7 X7.1
AIN_P2: X6.5 X7.5
AIN_P3: X6.3 X7.9
AIN_P4: X6.1 X7.13
U_In_Neg: X4.S1 X4.S2 X4.S3 X4.S4 X5.3
U_In_Pos: X3.3 X4.1
U_Poti: RP1.2 X3.1

Not connected (* = marked no-connect by the designer): X6 9* 10* 11* 12*

### Notes on the sheet
- Testsignal Sources
- (near X3) Select Testsignal Sources
- (near X3) use Testvoltage from Poti
- (near X3) use Testvoltage/-current from BNC
- (near RP1) create Testvoltage with Poti
- inject Testvoltage or Testcurrent
- via BNC connector
- (near X5) use Testvoltage from Poti
- (near X5) use Testvoltage/-current from BNC
- (near X6) Testsignals output to Analog Adaptercard via LAN Cable
- Jumper Testsignals to RJ45 connector
- Note: you can remove jumpers to direct connect the RJ45 connector or to interrupt the testsignal to specific ADC channels.
- Title
- Revision:
- Design Engineer:
- Date:
- Project:
- Sheet
- of

### Library data of the parts
RP1 = Trimmer_3299W: Square Trimpot(R) Trimming Potentiometer, 10kOhm, +/- 10%, 500 mW, -55 to 125 degC, 3-Pin THD, RoHS, Tube; MPN: 3299W-1-103LF; MF: Bourns; Value: 10k; ComponentLink1Description: Datasheet; ComponentLink1URL: http://www.bourns.com/docs/Product-Datasheets/3299.pdf; Supplier 1: Mouser; Supplier Part Number 1: 652-3299W-1-103LF; Created: 2020_12_15_AGeiger
X3 X5 = TSW-103-XX-XXX-S: as X8 on sheet Breakout_Connector; Created: 2020_11_26_AGeiger
X4 = BNC7T-J-P-XX-RA-BH1: BNC Connector Jack, Female Socket 75Ohm Panel Mount, Through Hole, Right Angle Solder; MPN: BNC7T-J-P-HN-RA-BH1; MF: Samtec; Package: BNC; Value: BNC; Created: 2021_04_06_AGeiger; ComponentLink1Description: Datasheet; ComponentLink1URL: https://suddendocs.samtec.com/catalog_english/bnc7t.pdf; ComponentLink2Description: URL; ComponentLink2URL: https://www.samtec.com/products/bnc7t-j-p-gn-ra-bh1
X6 = RJHSE-5381: RJ45 without integrated trafos; MF: Amphenol; OperationTempMin: -55°C; OperationTempMax: +85°C; MPN: RJHSE-5381; Created: 2021_03_11_AGeiger; Supplier 1: Mouser; Supplier Part Number 1: 523-RJHSE-5381; ComponentLink1Description: Datasheet; ComponentLink1URL: https://cdn.amphenol-icc.com/media/wysiwyg/files/drawing/rjhse538x.pdf; Value: RJHSE-5381; Package: RJ45
X7 = TSW-108-XX-XXX-D: Pin Header, 2.54mm; MPN: TSW-108-07-F-D; MF: SAMTEC; Value: TSW-108-07-F-D; Created: 2019_02_10_AGeiger

## Nets that join several sheets
3V3_PER: Adapter_Card_Connector (X1.13 X1.14 X2.13 X2.14), Breakout_Connector (X10.2)
3V3_PER_ONBOARD: Breakout_Connector (X10.3), Power_Supply (X18.2)
5V_PER: Adapter_Card_Connector (X1.9 X1.10 X2.9 X2.10), Breakout_Connector (X9.2), Analog_Testvoltage_Output (RP1.1)
5V_PER_ONBOARD: Breakout_Connector (X9.3), Power_Supply (X15.2)
GND: Adapter_Card_Connector (64 pins), Breakout_Connector (52 pins), Power_Supply (36 pins), Analog_Testvoltage_Output (RP1.3 X5.1)
VIN: Adapter_Card_Connector (X1.5 X1.6 X2.5 X2.6), Breakout_Connector (X8.2)
VIN_EXT: Breakout_Connector (X8.3), Power_Supply (L1.2 L2.2 X14.1 X16.4)
ANL_00_N: Adapter_Card_Connector (X1.19 X2.19), Breakout_Connector (X11.14 X12.15 X13.15)
ANL_00_P: Adapter_Card_Connector (X1.17 X2.17), Breakout_Connector (X11.15 X12.13 X13.13)
ANL_01_N: Adapter_Card_Connector (X1.20 X2.20), Breakout_Connector (X11.47 X12.16 X13.16)
ANL_01_P: Adapter_Card_Connector (X1.18 X2.18), Breakout_Connector (X11.48 X12.14 X13.14)
ANL_02_N: Adapter_Card_Connector (X1.25 X2.25), Breakout_Connector (X11.12 X12.21 X13.21)
ANL_02_P: Adapter_Card_Connector (X1.23 X2.23), Breakout_Connector (X11.13 X12.19 X13.19)
ANL_03_N: Adapter_Card_Connector (X1.26 X2.26), Breakout_Connector (X11.45 X12.22 X13.22)
ANL_03_P: Adapter_Card_Connector (X1.24 X2.24), Breakout_Connector (X11.46 X12.20 X13.20)
ANL_04_N: Adapter_Card_Connector (X1.31 X2.31), Breakout_Connector (X11.10 X12.27 X13.27)
ANL_04_P: Adapter_Card_Connector (X1.29 X2.29), Breakout_Connector (X11.11 X12.25 X13.25)
ANL_05_N: Adapter_Card_Connector (X1.32 X2.32), Breakout_Connector (X11.43 X12.28 X13.28)
ANL_05_P: Adapter_Card_Connector (X1.30 X2.30), Breakout_Connector (X11.44 X12.26 X13.26)
ANL_06_N: Adapter_Card_Connector (X1.37 X2.37), Breakout_Connector (X11.8 X12.33 X13.33)
ANL_06_P: Adapter_Card_Connector (X1.35 X2.35), Breakout_Connector (X11.9 X12.31 X13.31)
ANL_07_N: Adapter_Card_Connector (X1.38 X2.38), Breakout_Connector (X11.41 X12.34 X13.34)
ANL_07_P: Adapter_Card_Connector (X1.36 X2.36), Breakout_Connector (X11.42 X12.32 X13.32)
ANL_08_N: Adapter_Card_Connector (X1.43 X2.43), Breakout_Connector (X11.6 X12.39 X13.39)
ANL_08_P: Adapter_Card_Connector (X1.41 X2.41), Breakout_Connector (X11.7 X12.37 X13.37)
ANL_09_N: Adapter_Card_Connector (X1.44 X2.44), Breakout_Connector (X11.39 X12.40 X13.40)
ANL_09_P: Adapter_Card_Connector (X1.42 X2.42), Breakout_Connector (X11.40 X12.38 X13.38)
ANL_SPI_CLK: Adapter_Card_Connector (X1.48 X2.48), Breakout_Connector (X11.22 X12.44 X13.44)
ANL_SPI_CS: Adapter_Card_Connector (X1.53 X1.54 X2.53 X2.54), Breakout_Connector (X11.4 X12.47 X13.47)
ANL_SPI_MOSI: Adapter_Card_Connector (X1.47 X2.47), Breakout_Connector (X11.5 X12.43 X13.43)
Collective_FLT: Adapter_Card_Connector (X1.78 X2.78), Breakout_Connector (X11.18 X12.58 X13.58)
GTH_CLK_N: Adapter_Card_Connector (X1.74 X2.74), Breakout_Connector (X11.2 X12.54 X13.54)
GTH_CLK_P: Adapter_Card_Connector (X1.72 X2.72), Breakout_Connector (X11.19 X12.52 X13.52)
GTH_RX0_N: Adapter_Card_Connector (X1.71 X2.71), Breakout_Connector (X11.36 X12.55 X13.55)
GTH_RX0_P: Adapter_Card_Connector (X1.73 X2.73), Breakout_Connector (X11.35 X12.57 X13.57)
GTH_TX0_N: Adapter_Card_Connector (X1.67 X2.67), Breakout_Connector (X11.3 X12.53 X13.53)
GTH_TX0_P: Adapter_Card_Connector (X1.65 X2.65), Breakout_Connector (X11.20 X12.51 X13.51)
PILOT_IN: Adapter_Card_Connector (X1.80 X2.80), Breakout_Connector (X11.1 X12.60 X13.60)
PILOT_OUT: Adapter_Card_Connector (X1.79 X2.79), Breakout_Connector (X11.34 X12.59 X13.59)
PS_ANL_shared: Adapter_Card_Connector (X1.56 X2.56), Breakout_Connector (X11.37 X12.48 X13.48)
PS_I2C0_shared_SCL: Adapter_Card_Connector (X1.49 X2.49), Breakout_Connector (X11.38 X12.45 X13.45)
PS_I2C0_shared_SDA: Adapter_Card_Connector (X1.50 X2.50), Breakout_Connector (X11.21 X12.46 X13.46)